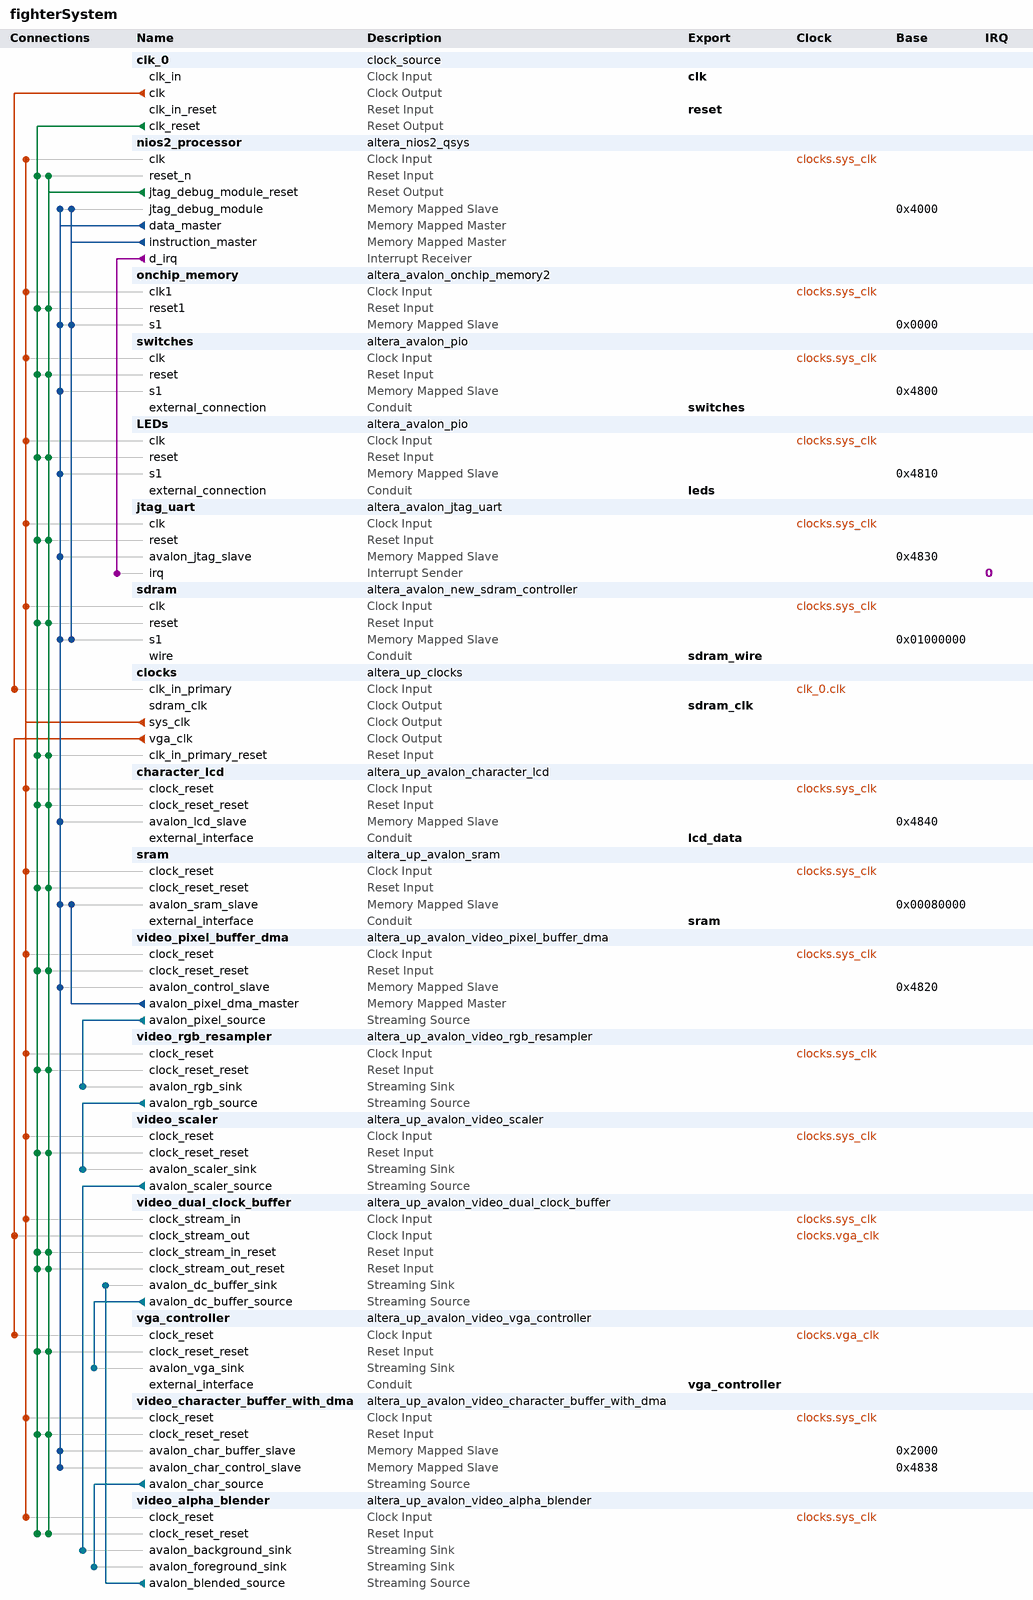
[diagram p0: system contents]
# Platform Designer (Qsys) system fighterSystem, Cyclone II EP2C35F672C6
# Parameters at their usual value, and those the tool derives, are not listed.
package require -exact qsys 12.0
create_system fighterSystem
set_project_property DEVICE_FAMILY {Cyclone II}
set_project_property DEVICE EP2C35F672C6

add_instance clk_0 clock_source 12.0
set_instance_parameter_value clk_0 clockFrequency 50000000

add_instance nios2_processor altera_nios2_qsys 12.0
set_instance_parameter_value nios2_processor resetSlave sdram.s1
set_instance_parameter_value nios2_processor exceptionSlave sdram.s1
set_instance_parameter_value nios2_processor breakSlave nios2_processor.jtag_debug_module
set_instance_parameter_value nios2_processor muldiv_multiplierType NoneSmall
set_instance_parameter_value nios2_processor impl Small
set_instance_parameter_value nios2_processor icache_size 4096

add_instance onchip_memory altera_avalon_onchip_memory2 12.0
set_instance_parameter_value onchip_memory dataWidth 32
set_instance_parameter_value onchip_memory dualPort false
set_instance_parameter_value onchip_memory initMemContent true
set_instance_parameter_value onchip_memory initializationFileName onchip_memory
set_instance_parameter_value onchip_memory memorySize 4096

add_instance switches altera_avalon_pio 12.0
set_instance_parameter_value switches direction Input
set_instance_parameter_value switches width 8

add_instance LEDs altera_avalon_pio 12.0
set_instance_parameter_value LEDs direction Output
set_instance_parameter_value LEDs width 8

add_instance jtag_uart altera_avalon_jtag_uart 12.0
set_instance_parameter_value jtag_uart simInteractiveOptions INTERACTIVE_ASCII_OUTPUT

add_instance sdram altera_avalon_new_sdram_controller 12.0
set_instance_parameter_value sdram TAC 5.5
set_instance_parameter_value sdram TRCD 20.0
set_instance_parameter_value sdram TRP 20.0
set_instance_parameter_value sdram casLatency 3
set_instance_parameter_value sdram columnWidth 8
set_instance_parameter_value sdram dataWidth 16
set_instance_parameter_value sdram generateSimulationModel false
set_instance_parameter_value sdram model custom
set_instance_parameter_value sdram numberOfBanks 4
set_instance_parameter_value sdram numberOfChipSelects 1
set_instance_parameter_value sdram powerUpDelay 100.0
set_instance_parameter_value sdram refreshPeriod 15.625
set_instance_parameter_value sdram rowWidth 12

add_instance clocks altera_up_clocks 12.0
set_instance_parameter_value clocks board DE2
set_instance_parameter_value clocks vga_clk true
set_instance_parameter_value clocks audio_clk false
set_instance_parameter_value clocks audio_clk_freq 12.288

add_instance character_lcd altera_up_avalon_character_lcd 12.0
set_instance_parameter_value character_lcd cursor Normal

add_instance sram altera_up_avalon_sram 12.0
set_instance_parameter_value sram board DE2
set_instance_parameter_value sram pixel_buffer true

add_instance video_pixel_buffer_dma altera_up_avalon_video_pixel_buffer_dma 12.0
set_instance_parameter_value video_pixel_buffer_dma addr_mode X-Y
set_instance_parameter_value video_pixel_buffer_dma start_address 0
set_instance_parameter_value video_pixel_buffer_dma back_start_address 0
set_instance_parameter_value video_pixel_buffer_dma image_width 320
set_instance_parameter_value video_pixel_buffer_dma image_height 240
set_instance_parameter_value video_pixel_buffer_dma color_space {16-bit RGB}

add_instance video_rgb_resampler altera_up_avalon_video_rgb_resampler 12.0
set_instance_parameter_value video_rgb_resampler input_type {16-bit RGB}
set_instance_parameter_value video_rgb_resampler output_type {30-bit RGB}
set_instance_parameter_value video_rgb_resampler alpha 1023

add_instance video_scaler altera_up_avalon_video_scaler 12.0
set_instance_parameter_value video_scaler width_scaling 2
set_instance_parameter_value video_scaler height_scaling 2
set_instance_parameter_value video_scaler width_in 320
set_instance_parameter_value video_scaler color_bits 10
set_instance_parameter_value video_scaler color_planes 3

add_instance video_dual_clock_buffer altera_up_avalon_video_dual_clock_buffer 12.0
set_instance_parameter_value video_dual_clock_buffer color_bits 10

add_instance vga_controller altera_up_avalon_video_vga_controller 12.0
set_instance_parameter_value vga_controller board DE2

add_instance video_character_buffer_with_dma altera_up_avalon_video_character_buffer_with_dma 12.0
set_instance_parameter_value video_character_buffer_with_dma enable_transparency true

add_instance video_alpha_blender altera_up_avalon_video_alpha_blender 12.0

# connections
add_connection clk_0.clk clocks.clk_in_primary clock
add_connection clocks.sys_clk character_lcd.clock_reset clock
add_connection clocks.sys_clk jtag_uart.clk clock
add_connection clocks.sys_clk LEDs.clk clock
add_connection clocks.sys_clk nios2_processor.clk clock
add_connection clocks.sys_clk onchip_memory.clk1 clock
add_connection clocks.sys_clk sdram.clk clock
add_connection clocks.sys_clk sram.clock_reset clock
add_connection clocks.sys_clk switches.clk clock
add_connection clocks.sys_clk video_alpha_blender.clock_reset clock
add_connection clocks.sys_clk video_character_buffer_with_dma.clock_reset clock
add_connection clocks.sys_clk video_dual_clock_buffer.clock_stream_in clock
add_connection clocks.sys_clk video_pixel_buffer_dma.clock_reset clock
add_connection clocks.sys_clk video_rgb_resampler.clock_reset clock
add_connection clocks.sys_clk video_scaler.clock_reset clock
add_connection clocks.vga_clk vga_controller.clock_reset clock
add_connection clocks.vga_clk video_dual_clock_buffer.clock_stream_out clock
add_connection clk_0.clk_reset character_lcd.clock_reset_reset reset
add_connection clk_0.clk_reset clocks.clk_in_primary_reset reset
add_connection clk_0.clk_reset jtag_uart.reset reset
add_connection clk_0.clk_reset LEDs.reset reset
add_connection clk_0.clk_reset nios2_processor.reset_n reset
add_connection clk_0.clk_reset onchip_memory.reset1 reset
add_connection clk_0.clk_reset sdram.reset reset
add_connection clk_0.clk_reset sram.clock_reset_reset reset
add_connection clk_0.clk_reset switches.reset reset
add_connection clk_0.clk_reset vga_controller.clock_reset_reset reset
add_connection clk_0.clk_reset video_alpha_blender.clock_reset_reset reset
add_connection clk_0.clk_reset video_character_buffer_with_dma.clock_reset_reset reset
add_connection clk_0.clk_reset video_dual_clock_buffer.clock_stream_in_reset reset
add_connection clk_0.clk_reset video_dual_clock_buffer.clock_stream_out_reset reset
add_connection clk_0.clk_reset video_pixel_buffer_dma.clock_reset_reset reset
add_connection clk_0.clk_reset video_rgb_resampler.clock_reset_reset reset
add_connection clk_0.clk_reset video_scaler.clock_reset_reset reset
add_connection nios2_processor.jtag_debug_module_reset character_lcd.clock_reset_reset reset
add_connection nios2_processor.jtag_debug_module_reset clocks.clk_in_primary_reset reset
add_connection nios2_processor.jtag_debug_module_reset jtag_uart.reset reset
add_connection nios2_processor.jtag_debug_module_reset LEDs.reset reset
add_connection nios2_processor.jtag_debug_module_reset nios2_processor.reset_n reset
add_connection nios2_processor.jtag_debug_module_reset onchip_memory.reset1 reset
add_connection nios2_processor.jtag_debug_module_reset sdram.reset reset
add_connection nios2_processor.jtag_debug_module_reset sram.clock_reset_reset reset
add_connection nios2_processor.jtag_debug_module_reset switches.reset reset
add_connection nios2_processor.jtag_debug_module_reset vga_controller.clock_reset_reset reset
add_connection nios2_processor.jtag_debug_module_reset video_alpha_blender.clock_reset_reset reset
add_connection nios2_processor.jtag_debug_module_reset video_character_buffer_with_dma.clock_reset_reset reset
add_connection nios2_processor.jtag_debug_module_reset video_dual_clock_buffer.clock_stream_in_reset reset
add_connection nios2_processor.jtag_debug_module_reset video_dual_clock_buffer.clock_stream_out_reset reset
add_connection nios2_processor.jtag_debug_module_reset video_pixel_buffer_dma.clock_reset_reset reset
add_connection nios2_processor.jtag_debug_module_reset video_rgb_resampler.clock_reset_reset reset
add_connection nios2_processor.jtag_debug_module_reset video_scaler.clock_reset_reset reset
add_connection nios2_processor.data_master character_lcd.avalon_lcd_slave avalon
set_connection_parameter_value nios2_processor.data_master/character_lcd.avalon_lcd_slave baseAddress 0x4840
add_connection nios2_processor.data_master jtag_uart.avalon_jtag_slave avalon
set_connection_parameter_value nios2_processor.data_master/jtag_uart.avalon_jtag_slave baseAddress 0x4830
add_connection nios2_processor.data_master LEDs.s1 avalon
set_connection_parameter_value nios2_processor.data_master/LEDs.s1 baseAddress 0x4810
add_connection nios2_processor.data_master nios2_processor.jtag_debug_module avalon
set_connection_parameter_value nios2_processor.data_master/nios2_processor.jtag_debug_module baseAddress 0x4000
add_connection nios2_processor.data_master onchip_memory.s1 avalon
set_connection_parameter_value nios2_processor.data_master/onchip_memory.s1 baseAddress 0x0000
add_connection nios2_processor.data_master sdram.s1 avalon
set_connection_parameter_value nios2_processor.data_master/sdram.s1 baseAddress 0x01000000
add_connection nios2_processor.data_master sram.avalon_sram_slave avalon
set_connection_parameter_value nios2_processor.data_master/sram.avalon_sram_slave baseAddress 0x00080000
add_connection nios2_processor.data_master switches.s1 avalon
set_connection_parameter_value nios2_processor.data_master/switches.s1 baseAddress 0x4800
add_connection nios2_processor.data_master video_character_buffer_with_dma.avalon_char_buffer_slave avalon
set_connection_parameter_value nios2_processor.data_master/video_character_buffer_with_dma.avalon_char_buffer_slave baseAddress 0x2000
add_connection nios2_processor.data_master video_character_buffer_with_dma.avalon_char_control_slave avalon
set_connection_parameter_value nios2_processor.data_master/video_character_buffer_with_dma.avalon_char_control_slave baseAddress 0x4838
add_connection nios2_processor.data_master video_pixel_buffer_dma.avalon_control_slave avalon
set_connection_parameter_value nios2_processor.data_master/video_pixel_buffer_dma.avalon_control_slave baseAddress 0x4820
add_connection nios2_processor.instruction_master nios2_processor.jtag_debug_module avalon
set_connection_parameter_value nios2_processor.instruction_master/nios2_processor.jtag_debug_module baseAddress 0x4000
add_connection nios2_processor.instruction_master nios2_processor.jtag_debug_module avalon
set_connection_parameter_value nios2_processor.instruction_master/nios2_processor.jtag_debug_module baseAddress 0x4000
add_connection nios2_processor.instruction_master onchip_memory.s1 avalon
set_connection_parameter_value nios2_processor.instruction_master/onchip_memory.s1 baseAddress 0x0000
add_connection nios2_processor.instruction_master sdram.s1 avalon
set_connection_parameter_value nios2_processor.instruction_master/sdram.s1 baseAddress 0x01000000
add_connection video_pixel_buffer_dma.avalon_pixel_dma_master sram.avalon_sram_slave avalon
set_connection_parameter_value video_pixel_buffer_dma.avalon_pixel_dma_master/sram.avalon_sram_slave baseAddress 0x00080000
add_connection video_alpha_blender.avalon_blended_source video_dual_clock_buffer.avalon_dc_buffer_sink avalon_streaming
add_connection video_character_buffer_with_dma.avalon_char_source video_alpha_blender.avalon_foreground_sink avalon_streaming
add_connection video_dual_clock_buffer.avalon_dc_buffer_source vga_controller.avalon_vga_sink avalon_streaming
add_connection video_pixel_buffer_dma.avalon_pixel_source video_rgb_resampler.avalon_rgb_sink avalon_streaming
add_connection video_rgb_resampler.avalon_rgb_source video_scaler.avalon_scaler_sink avalon_streaming
add_connection video_scaler.avalon_scaler_source video_alpha_blender.avalon_background_sink avalon_streaming
add_connection nios2_processor.d_irq jtag_uart.irq interrupt
set_connection_parameter_value nios2_processor.d_irq/jtag_uart.irq irqNumber 0

# exported interfaces
add_interface clk clock sink
set_interface_property clk EXPORT_OF clk_0.clk_in
add_interface reset reset sink
set_interface_property reset EXPORT_OF clk_0.clk_in_reset
add_interface switches conduit end
set_interface_property switches EXPORT_OF switches.external_connection
add_interface leds conduit end
set_interface_property leds EXPORT_OF LEDs.external_connection
add_interface sdram_wire conduit end
set_interface_property sdram_wire EXPORT_OF sdram.wire
add_interface sdram_clk clock source
set_interface_property sdram_clk EXPORT_OF clocks.sdram_clk
add_interface lcd_data conduit end
set_interface_property lcd_data EXPORT_OF character_lcd.external_interface
add_interface sram conduit end
set_interface_property sram EXPORT_OF sram.external_interface
add_interface vga_controller conduit end
set_interface_property vga_controller EXPORT_OF vga_controller.external_interface

save_system fighterSystem.qsys
